# Altium schematic sheet USB Cable Tester.SchDoc
size A; SheetNumber: 11; SheetTotal: 11
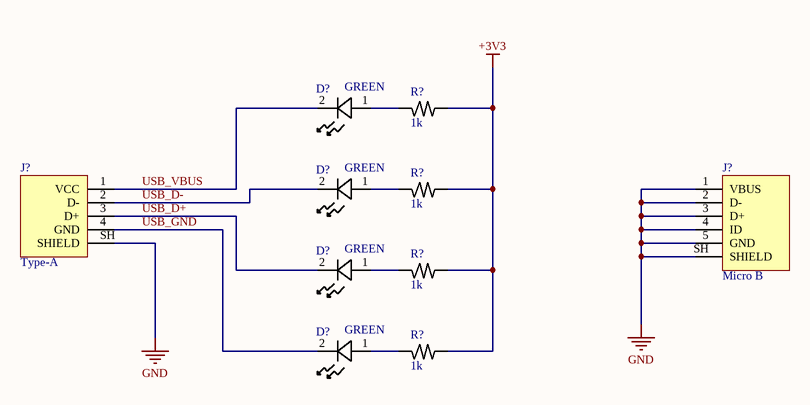
[diagram p0: USB Cable Tester.SchDoc]

## Parts
(Parts that share a designator on the sheet are numbered #1, #2 ... from top to bottom, then left to right.)
D?#1  GREEN  [LED0805 GREEN]
D?#2  GREEN  [LED0805 GREEN]
D?#3  GREEN  [LED0805 GREEN]
D?#4  GREEN  [LED0805 GREEN]
J?#1  Type-A  [USB Type-A Right Angle THT]
J?#2  Micro B  [USB Micro THT Mounting Holes]
R?#1  1k  [R0603]
R?#2  1k  [R0603]
R?#3  1k  [R0603]
R?#4  1k  [R0603]

## Nets
+3V3: R?#1.1 R?#2.1 R?#3.1 R?#4.1
GND: J?#1.SH(SHIELD) J?#2.1(VBUS) J?#2.2(D-) J?#2.3(D+) J?#2.4(ID) J?#2.5(GND) J?#2.SH(SHIELD)
USB_D+: D?#3.2 J?#1.3(D+)
USB_D-: D?#2.2 J?#1.2(D-)
USB_GND: D?#4.2 J?#1.4(GND)
USB_VBUS: D?#1.2 J?#1.1(VCC)
NetD?#1_1: D?#1.1 R?#1.2
NetD?#2_1: D?#2.1 R?#2.2
NetD?#3_1: D?#3.1 R?#3.2
NetD?#4_1: D?#4.1 R?#4.2

## Notes on the sheet
- Project:
- Sheet Title:
- Size
- Date:
- A
- Sheet Number:
- Sheet Total:
- Revision:
- Time:
- Author:

## Library data of the parts
D?#1-D?#4 = LED: LED EMERALD GREEN WATER CLEAR 0805 SMD; MF: XINGLIGHT; MP: XL-TD2012UGC; ComponentLink1Description: Datasheet; ComponentLink1URL: https://www.lcsc.com/datasheet/C5349942.pdf; ComponentLink2Description: Supplier1; ComponentLink2URL: https://www.lcsc.com/product-detail/C5349942.html
J?#1 = USB Type-A Right Angle: CONN RCPT USB 2.0 Type-A 4POS TH R/A; MF: kinghelm; MP: KH-AF90DIP-112; ComponentLink1Description: Datasheet; ComponentLink1URL: https://www.lcsc.com/datasheet/C503996.pdf; ComponentLink2Description: Supplier1; ComponentLink2URL: https://www.lcsc.com/product-detail/C503996.html
J?#2 = USB Micro THT Mounting Holes: CONN RCPT USB 2.0 Micro-B 5POS SMD; MF: Amphenol; MP: 10118194-0001LF; ComponentLink1Description: Datasheet; ComponentLink1URL: https://www.lcsc.com/datasheet/C132563.pdf; ComponentLink2Description: Supplier1; ComponentLink2URL: https://www.lcsc.com/product-detail/C132563.html
R?#1-R?#4 = Res: RES 1kΩ ±5% 100mW 0603; MF: VO; MP: SCR0603J1K; ComponentLink1Description: Datasheet; ComponentLink1URL: https://www.lcsc.com/datasheet/C3017736.pdf; ComponentLink2Description: Supplier1; ComponentLink2URL: https://www.lcsc.com/product-detail/C3017736.html